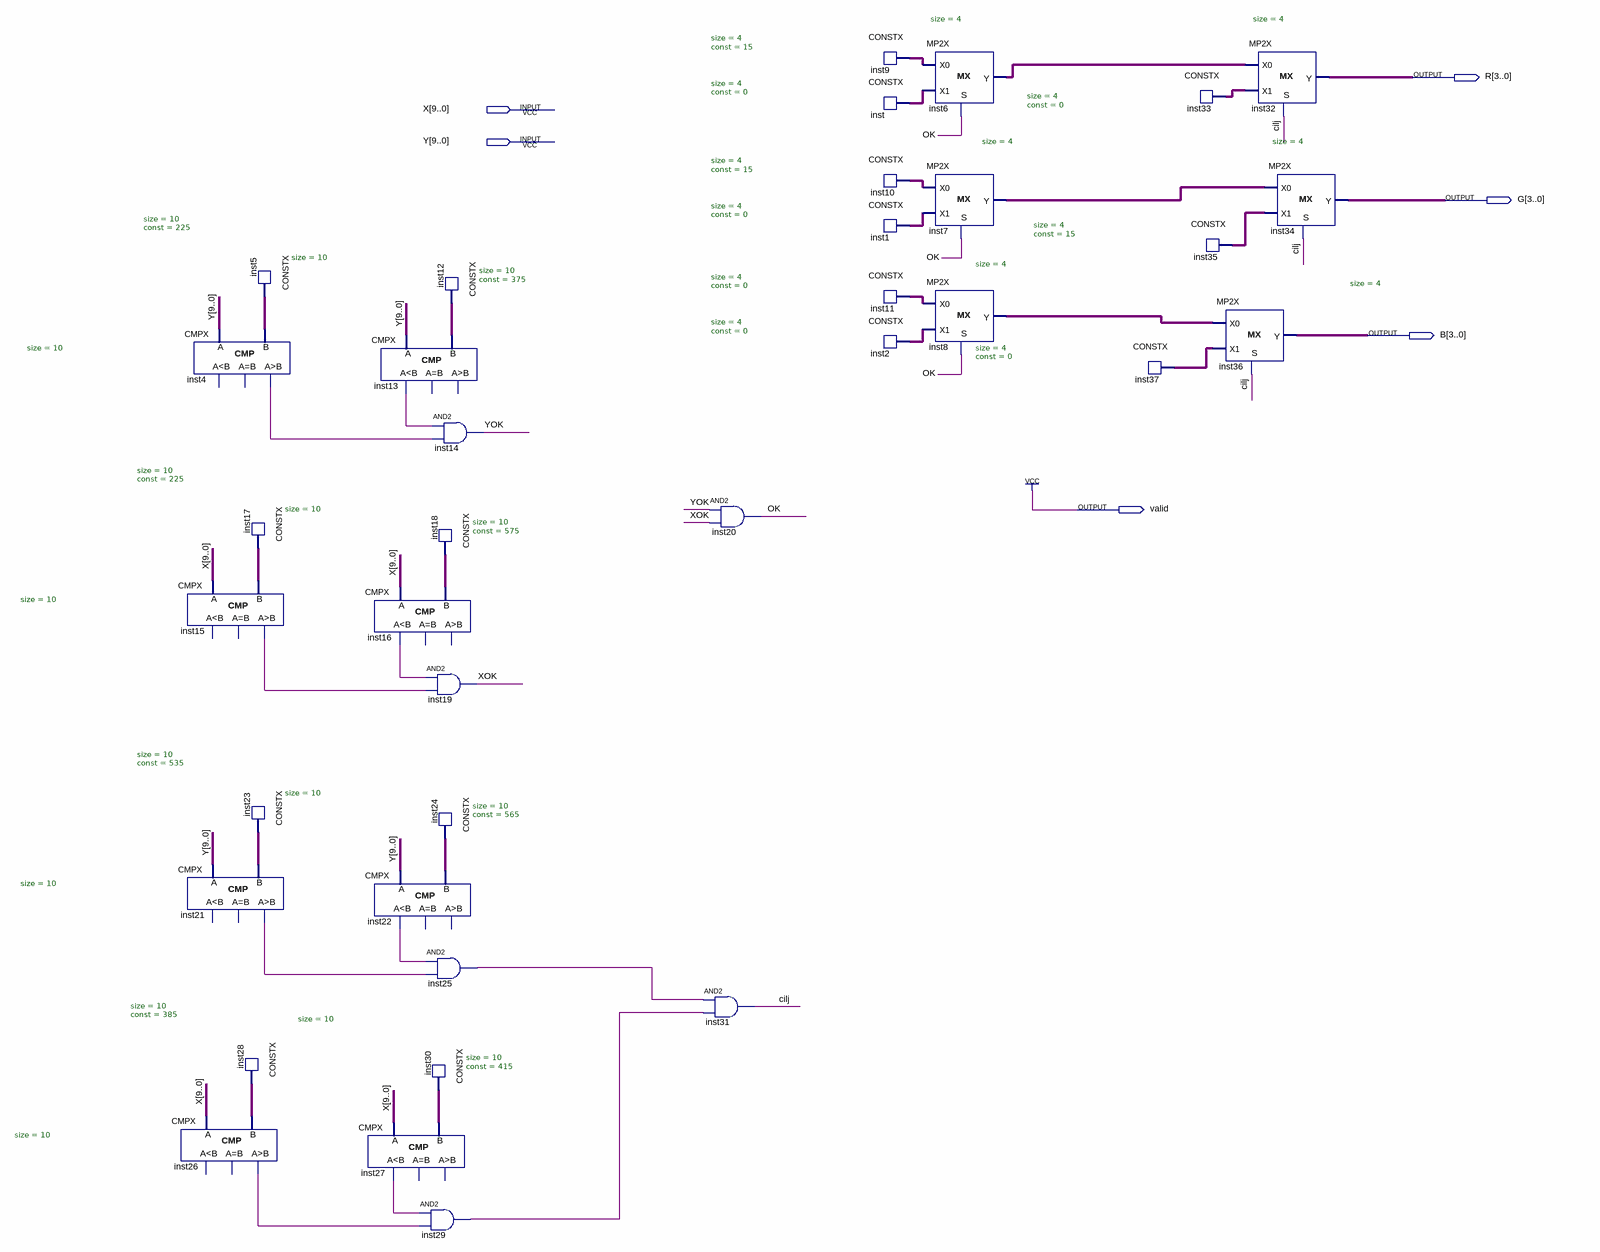
[diagram p0: schematic sheet]
// Quartus schematic Layer0.bdf as structural Verilog: 37 symbols, 6 pins
module Layer0 (
  input  [9:0] X,
  input  [9:0] Y,
  output [3:0] R,
  output [3:0] G,
  output [3:0] B,
  output valid
);

  wire cilj, inst4_gr, inst13_ls, inst15_gr, inst16_ls, inst21_gr, inst22_ls, inst25_out, inst26_gr,
       inst27_ls, inst29_out, OK, XOK, YOK;
  wire [3:0] inst1_data, inst2_data, inst6_y, inst7_y, inst8_y, inst9_data, inst10_data, inst11_data,
       inst33_data, inst35_data, inst37_data, inst_data;
  wire [9:0] inst5_data, inst12_data, inst17_data, inst18_data, inst23_data, inst24_data, inst28_data,
       inst30_data;

  CMPX #(.size(10)) inst4 (.A(Y), .B(inst5_data), .gr(inst4_gr));  // open: ls, eq
  CMPX #(.size(10)) inst15 (.A(X), .B(inst17_data), .gr(inst15_gr));  // open: ls, eq
  CMPX #(.size(10)) inst21 (.A(Y), .B(inst23_data), .gr(inst21_gr));  // open: ls, eq
  CMPX #(.size(10)) inst26 (.A(X), .B(inst28_data), .gr(inst26_gr));  // open: ls, eq
  CONSTX #(.size(10), .\const (225)) inst5 (.data(inst5_data));
  CONSTX #(.size(10), .\const (225)) inst17 (.data(inst17_data));
  CONSTX #(.size(10), .\const (535)) inst23 (.data(inst23_data));
  CONSTX #(.size(10), .\const (385)) inst28 (.data(inst28_data));
  CMPX #(.size(10)) inst13 (.A(Y), .B(inst12_data), .ls(inst13_ls));  // open: eq, gr
  CMPX #(.size(10)) inst16 (.A(X), .B(inst18_data), .ls(inst16_ls));  // open: eq, gr
  CMPX #(.size(10)) inst22 (.A(Y), .B(inst24_data), .ls(inst22_ls));  // open: eq, gr
  CMPX #(.size(10)) inst27 (.A(X), .B(inst30_data), .ls(inst27_ls));  // open: eq, gr
  CONSTX #(.size(10), .\const (415)) inst30 (.data(inst30_data));
  and inst29 (inst29_out, inst27_ls, inst26_gr);
  CONSTX #(.size(10), .\const (375)) inst12 (.data(inst12_data));
  and inst14 (YOK, inst13_ls, inst4_gr);
  CONSTX #(.size(10), .\const (575)) inst18 (.data(inst18_data));
  and inst19 (XOK, inst16_ls, inst15_gr);
  CONSTX #(.size(10), .\const (565)) inst24 (.data(inst24_data));
  and inst25 (inst25_out, inst22_ls, inst21_gr);
  and inst20 (OK, YOK, XOK);
  and inst31 (cilj, inst25_out, inst29_out);
  CONSTX #(.size(4), .\const (15)) inst9 (.data(inst9_data));
  CONSTX #(.size(4), .\const (0)) inst (.data(inst_data));
  CONSTX #(.size(4), .\const (15)) inst10 (.data(inst10_data));
  CONSTX #(.size(4), .\const (0)) inst1 (.data(inst1_data));
  CONSTX #(.size(4), .\const (0)) inst11 (.data(inst11_data));
  CONSTX #(.size(4), .\const (0)) inst2 (.data(inst2_data));
  MP2X #(.size(4)) inst6 (.S(OK), .X0(inst9_data), .X1(inst_data), .Y(inst6_y));
  MP2X #(.size(4)) inst7 (.S(OK), .X0(inst10_data), .X1(inst1_data), .Y(inst7_y));
  MP2X #(.size(4)) inst8 (.S(OK), .X0(inst11_data), .X1(inst2_data), .Y(inst8_y));
  CONSTX #(.size(4), .\const (0)) inst37 (.data(inst37_data));
  CONSTX #(.size(4), .\const (0)) inst33 (.data(inst33_data));
  CONSTX #(.size(4), .\const (15)) inst35 (.data(inst35_data));
  MP2X #(.size(4)) inst32 (.S(cilj), .X0(inst6_y), .X1(inst33_data), .Y(R));
  MP2X #(.size(4)) inst36 (.S(cilj), .X0(inst8_y), .X1(inst37_data), .Y(B));
  MP2X #(.size(4)) inst34 (.S(cilj), .X0(inst7_y), .X1(inst35_data), .Y(G));

  assign valid = 1'b1;
endmodule
